# Altium schematic sheet Relay.SchDoc
size Letter; DocumentNumber: 5; SheetNumber: 5; SheetTotal: 7
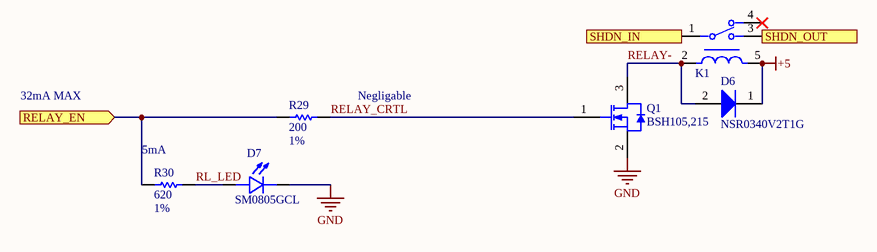
[diagram p0: Relay.SchDoc]

## Parts
D6  NSR0340V2T1G  [ONSC-SOD-523-2-502-01_V]
D7  SM0805GCL  [LEDC2012X135N_SM0805GCL(Primary)]
K1  Relay_Omron_Electronics_Inc._G5LE-1_DC5_eec  [Omron_Electronics_Inc._G5LE-1_DC5_0]  (value not drawn)
Q1  BSH105,215  [NXP-SOT23_M]
R29  Val: 200  Tol: 1%  [0603_RES]  (hidden comment: RES 0603 200 1%)
R30  Val: 620  Tol: 1%  [0603_RES]  (hidden comment: RES 0603 620 1%)

## Ports
RELAY_EN (in), SHDN_IN (in), SHDN_OUT (out)

## Nets
+5: D6.1(K) K1.5
GND: D7.C Q1.2(S)
RELAY-: D6.2(A) K1.2 Q1.3(D)
RELAY_CRTL: Q1.1(G) R29.2
RELAY_EN: R29.1 R30.1 ; port RELAY_EN
RL_LED: D7.A R30.2
SHDN_IN: K1.1 ; port SHDN_IN
SHDN_OUT: K1.3 ; port SHDN_OUT

Not connected (* = marked no-connect by the designer): K1 4*

## Notes on the sheet
- 32mA MAX
- (near R29) Negligable
- (near R30) 5mA
- Title
- Size:
- Date:
- Letter
- Number:
- Time:
- Revision:
- Sheet
- of
- File:

## Library data of the parts
D6 = CMP-1055-00486-1: Schottky Barrier Diode, 2-Pin SOD-523, Pb-Free, Tape and Reel; Manufacturer: On Semiconductor; IFSM Max (A): 1; Configuration: Single; PackageDescription: 2-Pin SOD, Body 1.2 x 0.8 mm; DatasheetVersion: Rev. 1; RoHS: TRUE; ComponentLink1Description: Manufacturer URL; ComponentLink2Description: Datasheet; PackageVersion: Rev. E, 09/2010; Packing: Tape and Reel; ComponentLink3Description: Package Specification; ComponentLink3URL: http://www.onsemi.com/pub_link/Collateral/502-01.PDF; ComponentLink2URL: http://www.onsemi.cn/pub_link/Collateral/NSR0340V2T1-D.PDF; PackageReference: SOD-523-2-502-01; PartNumber: NSR0340V2T1G; ComponentLink1URL: http://www.onsemi.com/; Mounting Technology: Surface Mount
D7 = SM0805GCL: Green 574nm LED Indication - Discrete 1.9V 0805 (2012 Metric); Supplier 1: Digi-Key; Supplier Part Number 1: 492-2525-1-ND
K1 = Relay_Omron_Electronics_Inc._G5LE-1_DC5_eec: RELAY GEN PURPOSE SPDT 10A 5V; Part Number: G5LE-1 DC5; Manufacturer: Omron Electronics Inc.; Voltage: 30V; coil_resistance: 63Ω; Operate Time: 10ms; Release Time: 5ms; Symbol 0 0: SPDT Relay; Num Pins: 5; helpURL: https://upverter.com/upn/revision/737368c9962922c8/; ComponentLink2Description: Datasheet; Temperature: -40°C to +85°C; Package: PTH_RELAY_21MM6_15MM6; Supplier 2: Mouser; Supplier 1: Digi-Key; ComponentLink1URL: https://upverter.com/upn/revision/737368c9962922c8/; Supplier Part Number 2: 653-G5LE-1-DC5; Supplier Part Number 1: Z1014-ND; ComponentLink1Description: Upverter; ComponentLink2URL: https://www.components.omron.com/components/web/PDFLIB.nsf/0/0293ACA6B03161CD86257538007424DB/$file/G5LE_0813.pdf; RoHS: TRUE; Mouser Part Number: 653-G5LE-1-DC5; coil_voltage: 5V; Temperature Range High: +85°C; Octopart Part Number: 11883359022; Digikey Description: RELAY GEN PURPOSE SPDT 10A 5V; Digikey Part Number: Z1014-ND; Type: integrated circuit; Lead Free: yes; Temperature Range Low: -40°C; contacts_type: SPDT; contact_current_rating: 10A
Q1 = CMP-1258-00134-1: N-Channel Enhancement Mode MOS Transistor, 20 V, 1.05 A, -55 to 150 degC, 3-Pin SOT23, Tape and Reel; Manufacturer: NXP Semiconductors; VDS [max] (V): 20; Packing: Tape & Reel; ID [max] (A): 1.05; Channel Type: N; Ciss [typ] (pF): 152; Coss [typ] (pF): 71; Qr [typ] (nC): 19; VGSth [typ] (V): 0.57; PackageDescription: 3-Pin Small Outline Transistor Package, Body 2.9 x 1.3 mm, Pitch 0.95 mm; ComponentLink2URL: http://www.nxp.com/documents/data_sheet/BSH105.pdf; ComponentLink3Description: Package Specification; ComponentLink2Description: Datasheet; Mounting Technology: Surface Mount; ComponentLink3URL: http://www.nxp.com/documents/outline_drawing/sot023_po.pdf; PartNumber: BSH105,215; DatasheetVersion: Rev. 1.000; ComponentLink1Description: Manufacturer URL; ComponentLink1URL: http://www.nxp.com/; PackageVersion: 06-03-16, 03/2006; PackageReference: SOT23; Code_JEDEC: TO-236AB
R29 = RES 0603 200 1%: Resistor Surface Mount, 200 Ohms, 0603 Footprint, 1% Tolerance 0.1W; Manufacturer: Various; PCB Package: 0603; Description in Visual: Res SMT 200 0603  1%  0.1W; Value: 200; P/N: RES 0603 200 1%; Manufacturer P/N: Various; Power_Rating: 0.1W; Tolerance: 1%
R30 = RES 0603 620 1%: Resistor Surface Mount, 620 Ohms, 0603 Footprint, 1% Tolerance 0.1W; Manufacturer: Various; PCB Package: 0603; Description in Visual: Res SMT 620 0603  1%  0.1W; Value: 620; P/N: RES 0603 620 1%; Manufacturer P/N: Various; Power_Rating: 0.1W; Tolerance: 1%